# EAGLE design Mid MCN Breakout (EAGLE 5.12)
PARTNO: RC0603JR-1010KL

## Sheet 1 of 2
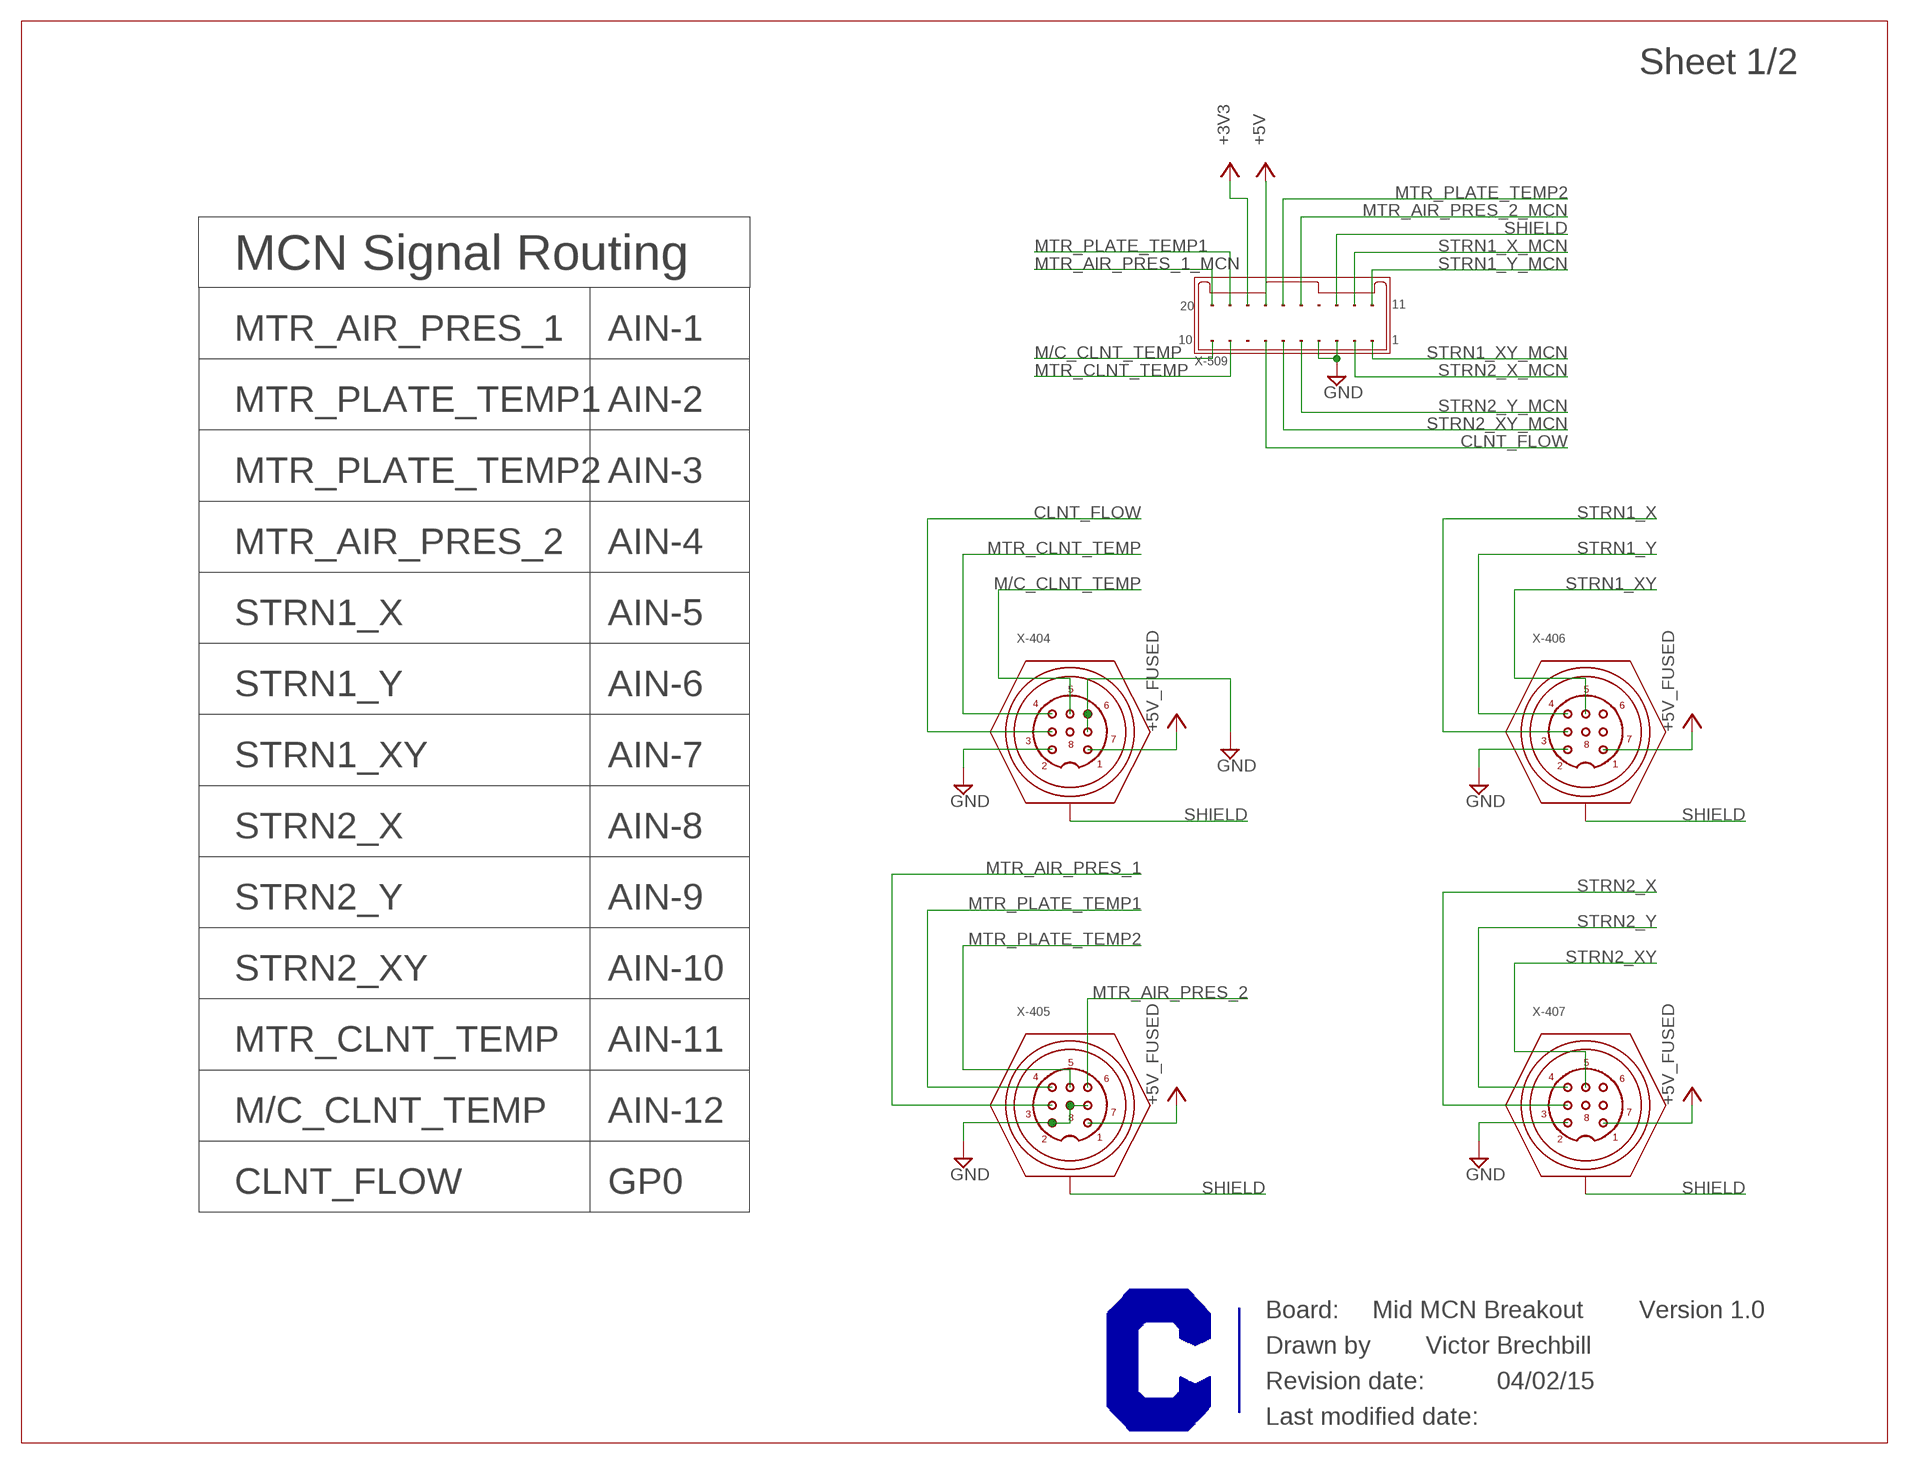
[diagram p0: schematic, sheet 1]

### Parts
U$5  CURRENT-C-LETTER-LANDSCAPE  [BLANK]
X-404  M8-8-VERT  [M8-VERT-8POS]
X-405  M8-8-VERT  [M8-VERT-8POS]
X-406  M8-8-VERT  [M8-VERT-8POS]
X-407  M8-8-VERT  [M8-VERT-8POS]
X-509  MICROCLASP-20-DUAL-RA  [MICROCLASP-20-DUAL-RA]

### Nets
+3V3: X-509.18 ; also sheet 2
+5V: X-509.17 ; also sheet 2
+5V_FUSED: X-404.P$1 X-405.P$1 X-406.P$1 X-407.P$1 ; supply symbol labelled VCC ; also sheet 2
CLNT_FLOW: X-404.P$3 X-509.7 ; also sheet 2
GND: X-404.P$2 X-404.P$6 X-404.P$7 X-405.P$2 X-405.P$7 X-405.P$8 X-406.P$2 X-407.P$2 X-509.3 X-509.4 ; also sheet 2
M/C_CLNT_TEMP: X-404.P$5 X-509.10 ; also sheet 2
MTR_AIR_PRES_1: X-405.P$3 ; also sheet 2
MTR_AIR_PRES_1_MCN: X-509.20 ; also sheet 2
MTR_AIR_PRES_2: X-405.P$6 ; also sheet 2
MTR_AIR_PRES_2_MCN: X-509.15 ; also sheet 2
MTR_CLNT_TEMP: X-404.P$4 X-509.9 ; also sheet 2
MTR_PLATE_TEMP1: X-405.P$4 X-509.19 ; also sheet 2
MTR_PLATE_TEMP2: X-405.P$5 X-509.16 ; also sheet 2
SHIELD: X-404.SHLD(SHIELD) X-405.SHLD(SHIELD) X-406.SHLD(SHIELD) X-407.SHLD(SHIELD) X-509.13
STRN1_X: X-406.P$3 ; also sheet 2
STRN1_X_MCN: X-509.12 ; also sheet 2
STRN1_XY: X-406.P$5 ; also sheet 2
STRN1_XY_MCN: X-509.1 ; also sheet 2
STRN1_Y: X-406.P$4 ; also sheet 2
STRN1_Y_MCN: X-509.11 ; also sheet 2
STRN2_X: X-407.P$3 ; also sheet 2
STRN2_X_MCN: X-509.2 ; also sheet 2
STRN2_XY: X-407.P$5 ; also sheet 2
STRN2_XY_MCN: X-509.6 ; also sheet 2
STRN2_Y: X-407.P$4 ; also sheet 2
STRN2_Y_MCN: X-509.5 ; also sheet 2
Unconnected: X-404.P$8 X-406.P$6 X-406.P$7 X-406.P$8 X-407.P$6 X-407.P$7 X-407.P$8 X-509.8 X-509.14

### Notes on the sheet
- MCN Signal Routing
- MTR_AIR_PRES_1 | AIN-1
- MTR_PLATE_TEMP1 | AIN-2
- MTR_PLATE_TEMP2 | AIN-3
- MTR_AIR_PRES_2 | AIN-4
- STRN1_X | AIN-5
- STRN1_Y | AIN-6
- +5V_FUSED | +5V_FUSED
- STRN1_XY | AIN-7
- STRN2_X | AIN-8
- STRN2_Y | AIN-9
- STRN2_XY | AIN-10
- MTR_CLNT_TEMP | AIN-11
- +5V_FUSED | +5V_FUSED
- M/C_CLNT_TEMP | AIN-12
- CLNT_FLOW | GP0
- Mid MCN Breakout | Version 1.0
- Victor Brechbill
- 04/02/15

## Sheet 2 of 2
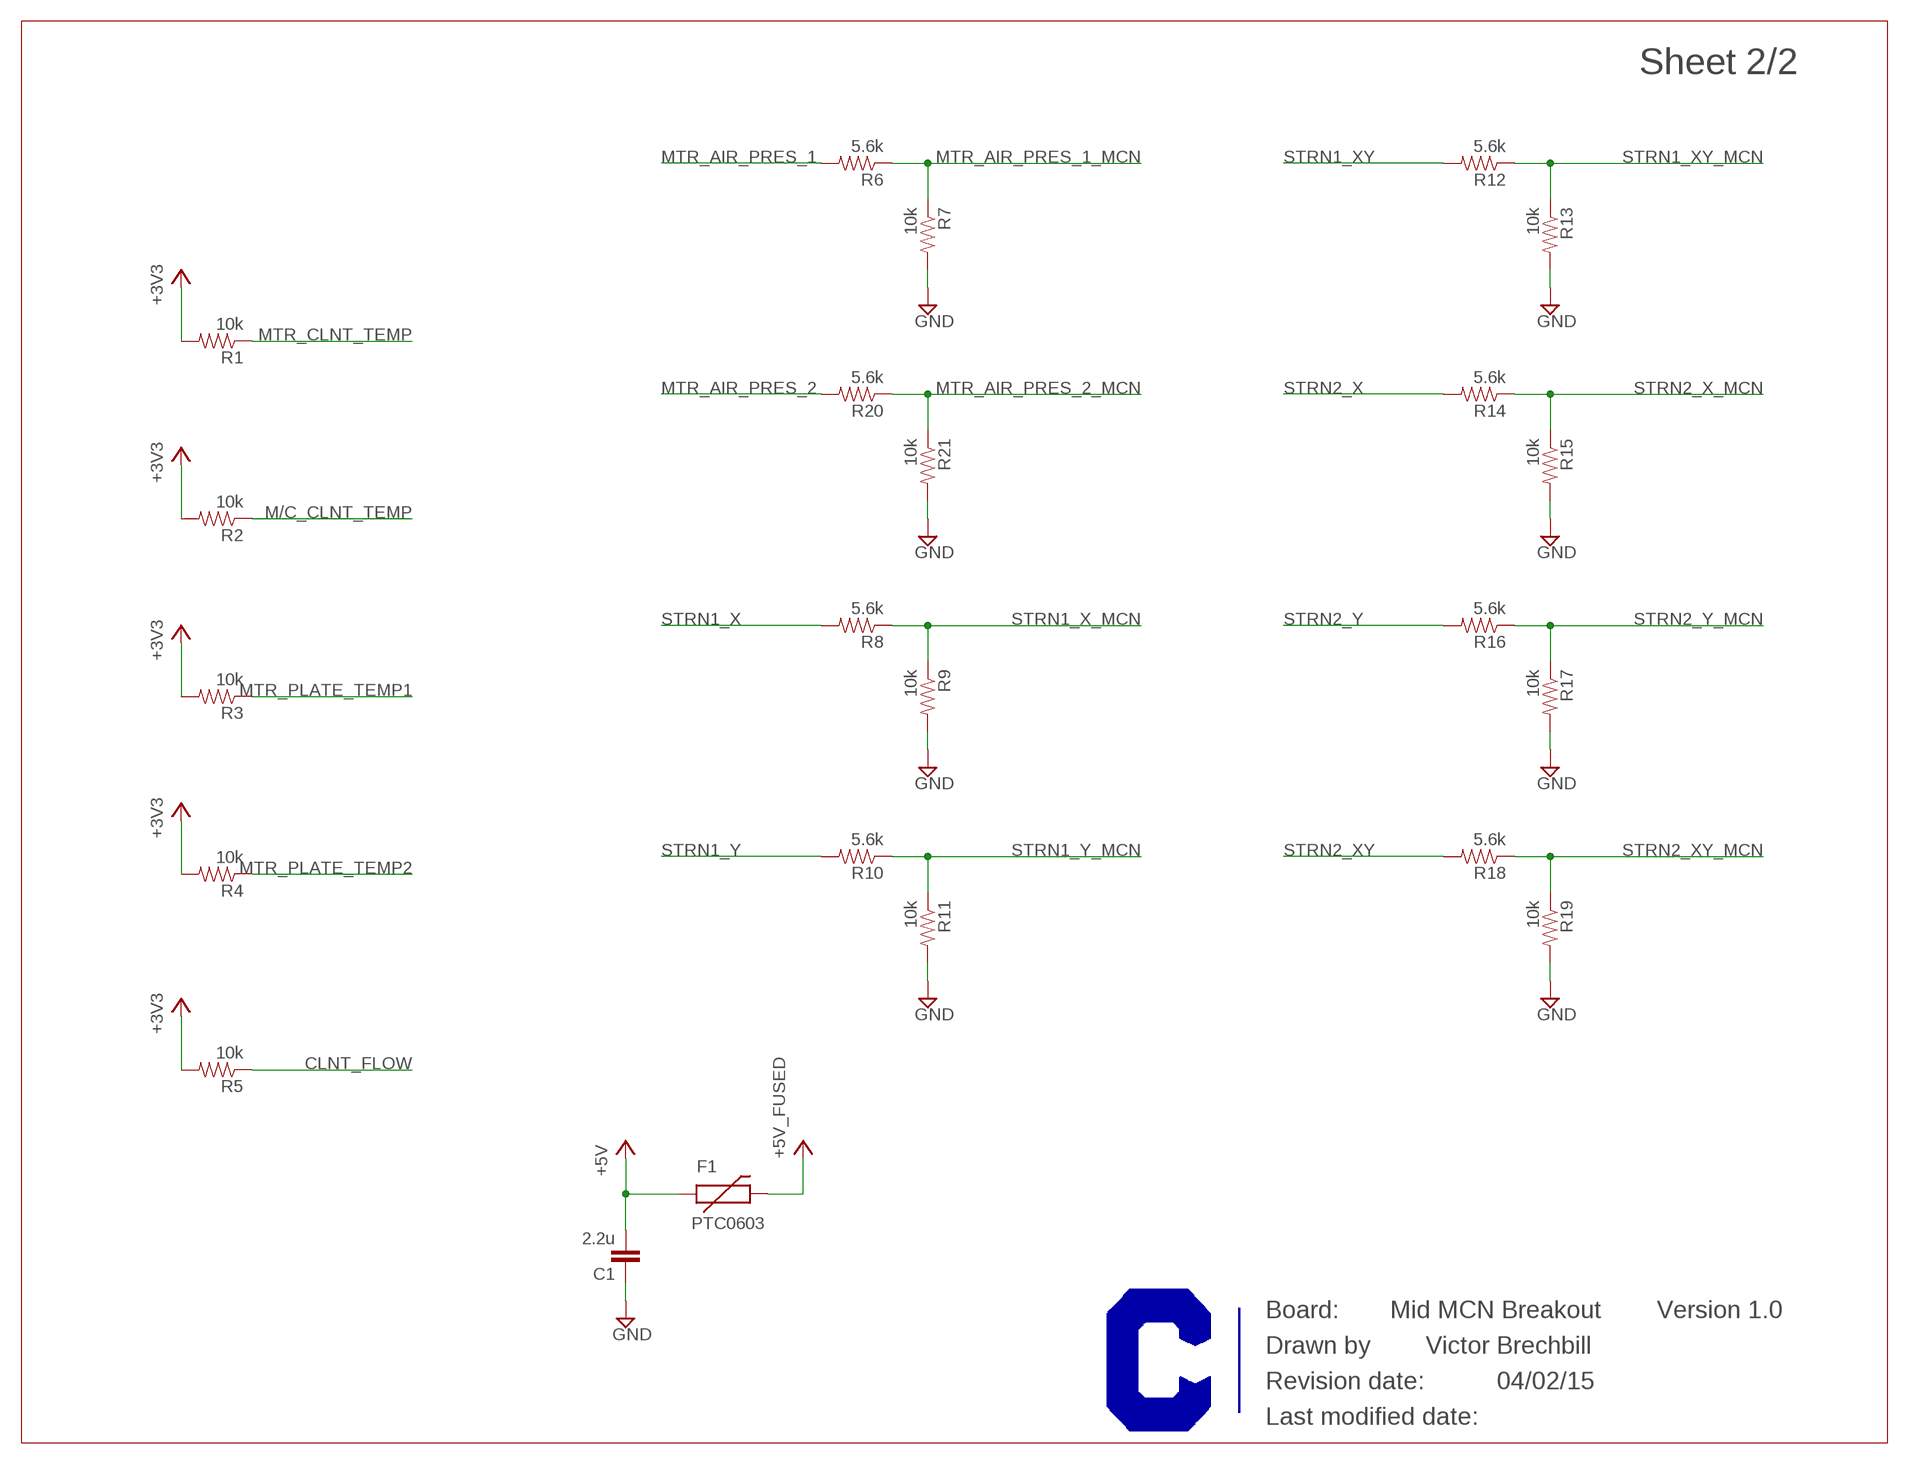
[diagram p1: schematic, sheet 2]

### Parts
C1  2.2u  CAP0603-CAP  [0603-CAP]
F1  PTC0603  [0603]
R1  10k  RESISTOR0603-RES  [0603-RES]
R2  10k  RESISTOR0603-RES  [0603-RES]
R3  10k  RESISTOR0603-RES  [0603-RES]
R4  10k  RESISTOR0603-RES  [0603-RES]
R5  10k  RESISTOR0603-RES  [0603-RES]
R6  5.6k  RESISTOR0603-RES  [0603-RES]
R7  10k  RESISTOR0603-RES  [0603-RES]
R8  5.6k  RESISTOR0603-RES  [0603-RES]
R9  10k  RESISTOR0603-RES  [0603-RES]
R10  5.6k  RESISTOR0603-RES  [0603-RES]
R11  10k  RESISTOR0603-RES  [0603-RES]
R12  5.6k  RESISTOR0603-RES  [0603-RES]
R13  10k  RESISTOR0603-RES  [0603-RES]
R14  5.6k  RESISTOR0603-RES  [0603-RES]
R15  10k  RESISTOR0603-RES  [0603-RES]
R16  5.6k  RESISTOR0603-RES  [0603-RES]
R17  10k  RESISTOR0603-RES  [0603-RES]
R18  5.6k  RESISTOR0603-RES  [0603-RES]
R19  10k  RESISTOR0603-RES  [0603-RES]
R20  5.6k  RESISTOR0603-RES  [0603-RES]
R21  10k  RESISTOR0603-RES  [0603-RES]
U$1  CURRENT-C-LETTER-LANDSCAPE  [BLANK]

### Nets
+3V3: R1.2 R2.2 R3.2 R4.2 R5.2 ; also sheet 1
+5V: C1.2 F1.1 ; also sheet 1
+5V_FUSED: F1.2 ; supply symbol labelled VCC ; also sheet 1
CLNT_FLOW: R5.1 ; also sheet 1
GND: C1.1 R7.2 R9.2 R11.2 R13.2 R15.2 R17.2 R19.2 R21.2 ; also sheet 1
M/C_CLNT_TEMP: R2.1 ; also sheet 1
MTR_AIR_PRES_1: R6.2 ; also sheet 1
MTR_AIR_PRES_1_MCN: R6.1 R7.1 ; also sheet 1
MTR_AIR_PRES_2: R20.2 ; also sheet 1
MTR_AIR_PRES_2_MCN: R20.1 R21.1 ; also sheet 1
MTR_CLNT_TEMP: R1.1 ; also sheet 1
MTR_PLATE_TEMP1: R3.1 ; also sheet 1
MTR_PLATE_TEMP2: R4.1 ; also sheet 1
STRN1_X: R8.2 ; also sheet 1
STRN1_X_MCN: R8.1 R9.1 ; also sheet 1
STRN1_XY: R12.2 ; also sheet 1
STRN1_XY_MCN: R12.1 R13.1 ; also sheet 1
STRN1_Y: R10.2 ; also sheet 1
STRN1_Y_MCN: R10.1 R11.1 ; also sheet 1
STRN2_X: R14.2 ; also sheet 1
STRN2_X_MCN: R14.1 R15.1 ; also sheet 1
STRN2_XY: R18.2 ; also sheet 1
STRN2_XY_MCN: R18.1 R19.1 ; also sheet 1
STRN2_Y: R16.2 ; also sheet 1
STRN2_Y_MCN: R16.1 R17.1 ; also sheet 1

### Notes on the sheet
- +5V_FUSED
- Mid MCN Breakout | Version 1.0
- Victor Brechbill
- 04/02/15

## Library data of the parts
C1 = SparkFun:CAP: Capacitor Standard 0603 ceramic capacitor, and 0.1" leaded capacitor.
F1 = SparkFun:PTC: Resettable Fuse PTC Resettable Fuse. Spark Fun Electronics SKU : COM-08357
R1-R21 = SparkFun:RESISTOR: Resistor Basic schematic elements and footprints for 0603, 1206, and PTH resistors.
U$1 U$5 = Frames:CURRENT-C-LETTER-LANDSCAPE; BOM: EXCLUDE
X-404-X-407 = Conec:M8-8; PARTNO: 42-01146
X-509 = Molex:MICROCLASP-20-DUAL

## Board
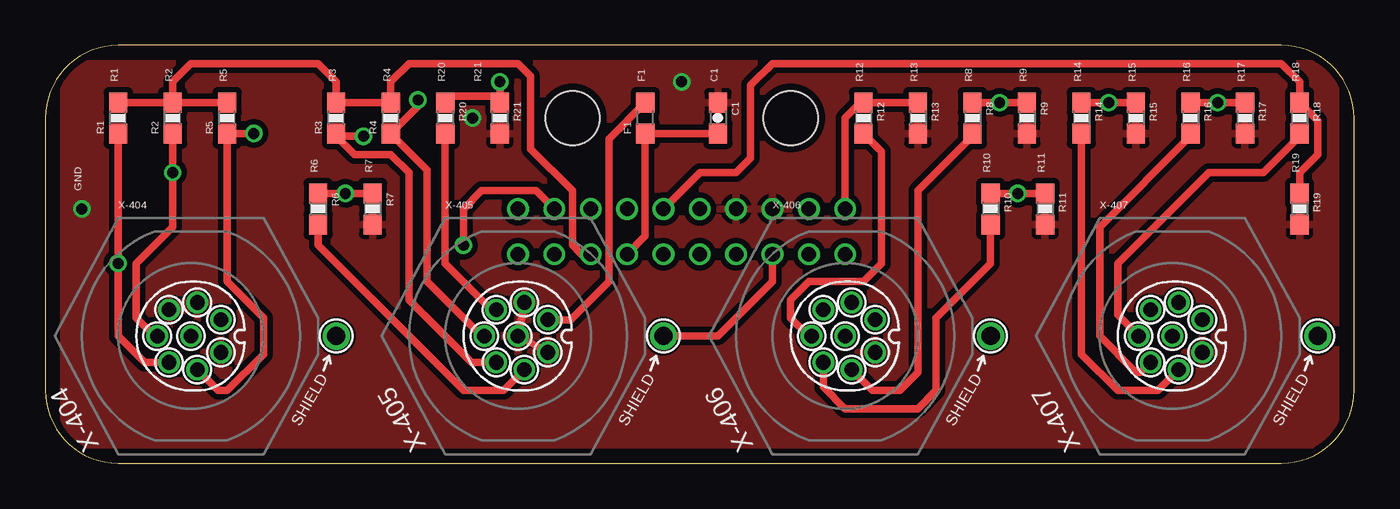
[diagram p2: board, top side]
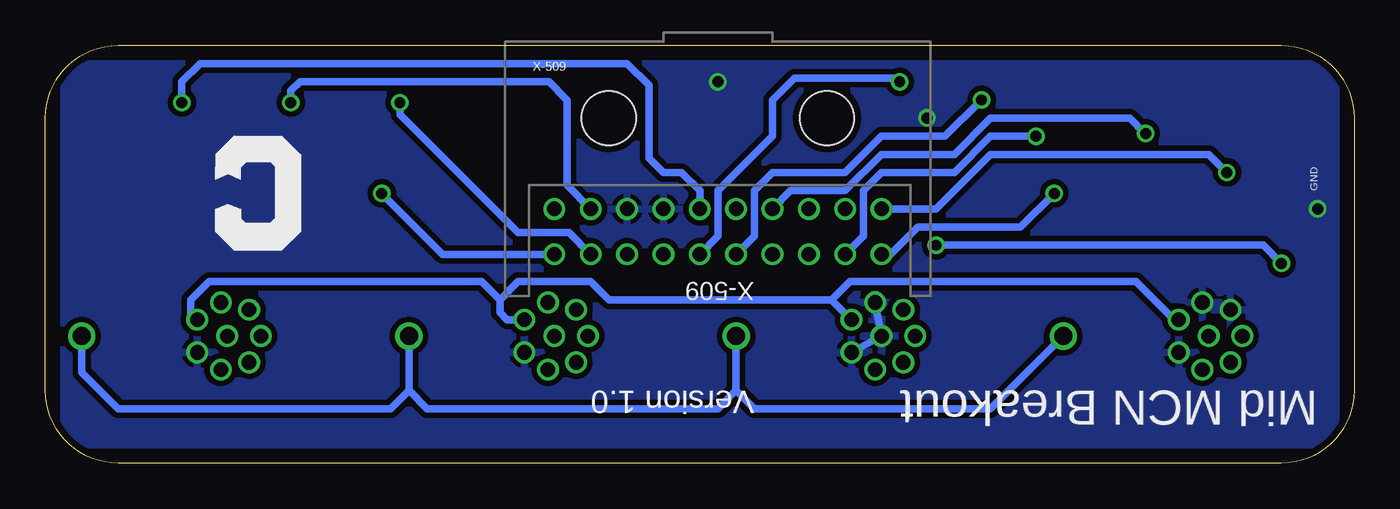
[diagram p3: board, bottom side, seen from below]

Size 72 x 23 mm. Coordinates in mm from the lower left corner, seen from the top.
Outline: 4,23 arc90 0,19 0,4 arc90 4,0 68,0 arc90 72,4 72,19 arc90 68,23 4,23
Copper layers (1*16): Top 0.0356mm / dielectric 1.5011mm / Bottom 0.0356mm
Design rules "OSH Park 2-layer": minimum track width 6mil, minimum drill 13mil, track to track 6mil, track to pad 6mil, pad to pad 6mil, via to via 6mil, smd to smd 6mil, copper to edge 15mil, drill to drill 6mil, minimum pad ring 7mil, minimum via ring 7mil, stop-mask expansion 4mil, vias tented up to drill 25mil, thermal gap 10mil
Holes 3 mm at 29,19 41,19

### Footprints (pad centres in the part's own frame; a part is rotated, then mirrored left to right if it is on the bottom)
0603-CAP = smd 1.1 x 1: 1 -0.85,0; 2 0.85,0
0603 = smd 1.1 x 1: 1 -0.85,0; 2 0.85,0
0603-RES = smd 1.1 x 1: 1 -0.85,0; 2 0.85,0
M8-VERT-8POS = drill 0.8 round: P$1 1.65,0.9; P$2 1.65,-0.9; P$3 0.35,-1.85; P$4 -1.2,-1.45; P$5 -1.85,0; P$6 -1.2,1.45; P$7 0.35,1.85; P$8 0,0 | drill 1 round: SHLD 8,0
MICROCLASP-20-DUAL-RA = drill 0.8 round: 1 -9,0; 2 -7,0; 3 -5,0; 4 -3,0; 5 -1,0; 6 1,0; 7 3,0; 8 5,0; 9 7,0; 10 9,0; 11 -9,-2.5; 12 -7,-2.5; 13 -5,-2.5; 14 -3,-2.5; 15 -1,-2.5; 16 1,-2.5; 17 3,-2.5; 18 5,-2.5; 19 7,-2.5; 20 9,-2.5

### Placement (x,y rotation side)
C1  37,19 270 top
F1  33,19 90 top
R1  4,19 90 top
R2  7,19 90 top
R3  16,19 90 top
R4  19,19 90 top
R5  10,19 90 top
R6  15,14 270 top
R7  18,14 270 top
R8  51,19 270 top
R9  54,19 270 top
R10  52,14 270 top
R11  55,14 270 top
R12  45,19 270 top
R13  48,19 270 top
R14  57,19 270 top
R15  60,19 270 top
R16  63,19 270 top
R17  66,19 270 top
R18  69,19 270 top
R19  69,14 270 top
R20  22,19 270 top
R21  25,19 270 top
U$1  -41.91,50.8 0 top  (outside the outline)
U$5  -44.45,50.8 0 top  (outside the outline)
X-404  8,7 0 top
X-405  26,7 0 top
X-406  44,7 0 top
X-407  62,7 0 top
X-509  35,14 0 bottom

### Tracks (layer width: path | path; a pad name or v marks a point on that pad's centre or on a via)
+3V3
  Top 0.406: R1.2 R2.2 | X-509.18 29.5,11.5 29,12 29,15 26.7,17.3 26.7,21.3 26,22 20,22 19,21 R4.2 R3.2 16,21 15,22 8,22 7,21 R2.2 | R2.2 R5.2
+5V
  Top 0.406: X-509.17 33,12.5 F1.1 C1.2
+5V_FUSED
  Top 0.406: F1.2 31,17.85 31,10 28.9,7.9 X-405.P$1
  Bottom 0.406: 47,9 48,10 63,10 64,9 64,8.25 X-407.P$1 | 47,9 46,10 42,10 41,9 28.75,9 | 47,9 47,8.3 46.6,7.9 X-406.P$1 | 28.75,9 X-405.P$1 | X-404.P$1 9.9,7.9 12,10 27.75,10 28.75,9
CLNT_FLOW  (via drill 0.6)
  Top 0.406: X-404.P$3 9.5,4 10,4 12,6 12,8 10,10 R5.1 v11.46,18.15
  Bottom 0.406: X-509.7 31,15 28,15 26,17 22,17 20,19 12.35,19 11.5,18.15 v11.46,18.15
GND  (via drill 0.6)
  Top 0.406: X-405.P$7 X-405.P$8 27.67,6.09
  Bottom 0.406: X-405.P$2 X-405.P$8 X-405.P$7
  other vias: 35,21 23.5,19 2,14
  pour Top (isolate 0.305): 1,22 71,22 71,1 1,1
  pour Bottom (isolate 0.305): 1,22 71,22 71,1 1,1
M/C_CLNT_TEMP  (via drill 0.6)
  Top 0.406: X-404.P$5 6,7 5,8 5,11 7,13 v7,16 R2.1
  Bottom 0.406: X-509.10 23,14 20,17 8,17 v7,16
MTR_AIR_PRES_1
  Top 0.406: X-405.P$3 25.2,4 23,4 15,12 R6.2
MTR_AIR_PRES_1_MCN  (via drill 0.6)
  Top 0.406: R7.1 v16.5,14.85 R6.1
  Bottom 0.406: v16.5,14.85 18.35,13 24,13 25.5,11.5 X-509.20
MTR_AIR_PRES_2
  Top 0.406: X-405.P$6 24.55,8.45 22,11 R20.2
MTR_AIR_PRES_2_MCN  (via drill 0.6)
  Top 0.406: 25,20.2 R21.1 | 25,20.2 22.35,20.2 R20.1 | 25,20.2 v25,21
  Bottom 0.406: X-509.15 35,12.5 35,15 32,18 32,20 30.8,21.2 25.2,21.2 v25,21
MTR_CLNT_TEMP  (via drill 0.6)
  Top 0.406: X-404.P$4 5.45,5.55 4,7 4,10 v4,11 R1.1 | v23,12 23,14 24,15 27,15 X-509.9
  Bottom 0.406: v23,12 5,12 v4,11
MTR_PLATE_TEMP1  (via drill 0.6)
  Top 0.406: X-405.P$4 23.45,5.55 20,9 20,16 19,17 17,17 16,18 R3.1 16.15,18 v17.5,18
  Bottom 0.406: X-509.19 27,12.5 27,15 26,16 22,16 20,18 v17.5,18
MTR_PLATE_TEMP2  (via drill 0.6)
  Top 0.406: X-405.P$5 24,7 21,10 21,16.15 R4.1 20.5,19.65 v20.5,20
  Bottom 0.406: X-509.16 33,12.5 33,15 32,16 28,16 26,18 22.5,18 v20.5,20
SHIELD
  Top 0.406: X-405.SHLD 37,7 40,10 X-509.13
  Bottom 0.406: X-404.SHLD 20,3 33,3 34,4 | 34,4 35,3 51,3 52,4 | 52,4 53,3 68,3 70,5 X-407.SHLD | 52,4 X-406.SHLD | 34,4 X-405.SHLD
STRN1_X
  Top 0.406: X-406.P$3 45.5,4 47,4 48,5 48,15 51,18 R8.2
STRN1_X_MCN  (via drill 0.6)
  Top 0.406: R8.1 v52.5,19.85 53,19.85 R9.1
  Bottom 0.406: X-509.12 43.2,12.7 46,12.7 52.5,19.2 v52.5,19.85
STRN1_XY
  Top 0.406: X-406.P$5 42,7 41,8 41,9 42,10 45,10 46,11 46,17.15 R12.2
STRN1_XY_MCN
  Top 0.406: R13.1 R12.1 44.85,19.85 44,19 X-509.1
STRN1_Y
  Top 0.406: X-406.P$4 42.8,4.2 44,3 48,3 49,4 49,8 52,11 R10.2
STRN1_Y_MCN  (via drill 0.6)
  Top 0.406: R10.1 v53.5,14.85 R11.1
  Bottom 0.406: X-509.11 50.15,11.5 v53.5,14.85
STRN2_X
  Top 0.406: X-407.P$3 61.2,4 59,4 57,6 R14.2
STRN2_X_MCN  (via drill 0.6)
  Top 0.406: R14.1 v58.5,19.85 R15.1
  Bottom 0.406: v58.5,19.85 58.5,20.5 58,21 44.3,21 43.3,20 43.3,15.3 X-509.2
STRN2_XY
  Top 0.406: X-407.P$5 59,8.15 59,11 64,16 67,16 69,18 R18.2
STRN2_XY_MCN
  Top 0.406: R19.1 69,16 70,17 70,18.85 R18.1 69,21 68,22 40,22 38.8,20.8 38.8,16.8 38,16 36,16 X-509.6
STRN2_Y
  Top 0.406: X-407.P$4 60.25,5 60,5 58,7 58,13 63,18 R16.2
STRN2_Y_MCN  (via drill 0.6)
  Top 0.406: R16.1 v64.5,19.85 R17.1
  Bottom 0.406: X-509.5 36,15 37,16 38,16 38.8,16.8 38.8,20.8 40,22 63.5,22 64.5,21 v64.5,19.85

### Text on the board
_tsilk: R1 | R2 | R5 | R3 | R4 | R20 | R21 | F1 | C1 | R12 | R13 | R8 | R9 | R14 | R15 | R16 | R17 | R18 | R6 | R7 | R10 | R11 | R19 | GND | X-404 | X-405 | X-406 | X-407
_bsilk: GND | X-509 | Mid MCN Breakout | Version 1.0